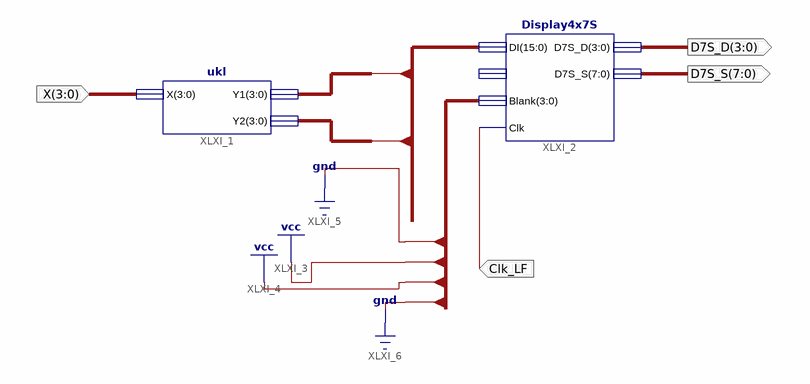
[diagram p0: schematic sheet 1]
// Xilinx ISE schematic schem.sch (xc9500xl) as structural Verilog: 2 symbols, 4 ports
module schem (
  input  [3:0] X,
  input  Clk_LF,
  output [3:0] D7S_D,
  output [7:0] D7S_S
);

  wire [15:0] Y;

  ukl XLXI_1 (.X(X), .Y1(Y[3:0]), .Y2(Y[15:12]));
  Display4x7S XLXI_2 (.DI(Y), .D7S_D(D7S_D), .D7S_S(D7S_S), .Clk(Clk_LF), .Blank(4'b0110));  // open: DP
endmodule
